# Altium schematic sheet UserJtagTester.schDOC
size A4; Organization: Altium Limited; Address1: L3, 12a Rodborough Rd; Address2: Frenchs Forest; Address3: NSW; Address4: Australia 2086; DocumentNumber: 1; SheetNumber: 13; SheetTotal: 13
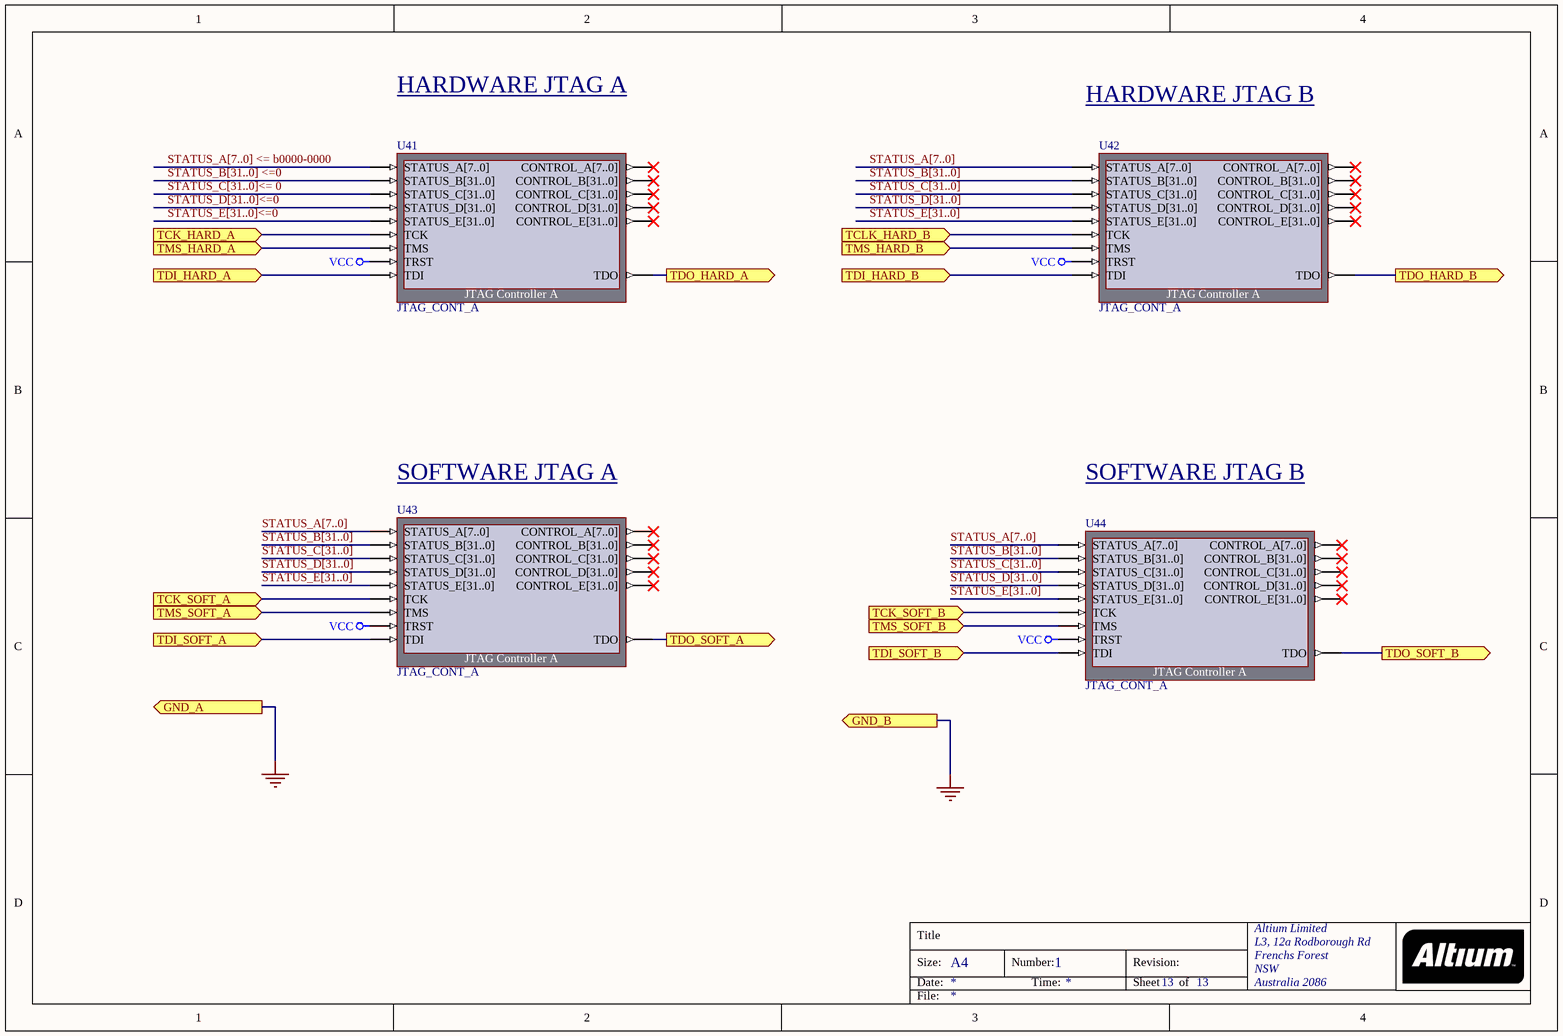
[diagram p0: UserJtagTester.schDOC]

## Parts
U41  JTAG_CONT_A
U42  JTAG_CONT_A
U43  JTAG_CONT_A
U44  JTAG_CONT_A

## Ports
GND_A (out), GND_B (out), TCK_HARD_A (in), TCK_SOFT_A (in), TCK_SOFT_B (in), TCLK_HARD_B (in), TDI_HARD_A (in), TDI_HARD_B (in), TDI_SOFT_A (in), TDI_SOFT_B (in), TDO_HARD_A (out), TDO_HARD_B (out), TDO_SOFT_A (out), TDO_SOFT_B (out), TMS_HARD_A (in), TMS_HARD_B (in), TMS_SOFT_A (in), TMS_SOFT_B (in)

## Nets
GND: port GND_A, port GND_B
VCC: U41.TRST U42.TRST U43.TRST U44.TRST
STATUS_A[7..0]: U42.STATUS_A[7..0] U43.STATUS_A[7..0] U44.STATUS_A[7..0]
STATUS_A[7..0] <= b0000-0000: U41.STATUS_A[7..0]
STATUS_B[31..0]: U42.STATUS_B[31..0] U43.STATUS_B[31..0] U44.STATUS_B[31..0]
STATUS_B[31..0] <=0: U41.STATUS_B[31..0]
STATUS_C[31..0]: U42.STATUS_C[31..0] U43.STATUS_C[31..0] U44.STATUS_C[31..0]
STATUS_C[31..0]<= 0: U41.STATUS_C[31..0]
STATUS_D[31..0]: U42.STATUS_D[31..0] U43.STATUS_D[31..0] U44.STATUS_D[31..0]
STATUS_D[31..0]<=0: U41.STATUS_D[31..0]
STATUS_E[31..0]: U42.STATUS_E[31..0] U43.STATUS_E[31..0] U44.STATUS_E[31..0]
STATUS_E[31..0]<=0: U41.STATUS_E[31..0]
TCK_HARD_A: U41.TCK ; port TCK_HARD_A
TCK_SOFT_A: U43.TCK ; port TCK_SOFT_A
TCK_SOFT_B: U44.TCK ; port TCK_SOFT_B
TCLK_HARD_B: U42.TCK ; port TCLK_HARD_B
TDI_HARD_A: U41.TDI ; port TDI_HARD_A
TDI_HARD_B: U42.TDI ; port TDI_HARD_B
TDI_SOFT_A: U43.TDI ; port TDI_SOFT_A
TDI_SOFT_B: U44.TDI ; port TDI_SOFT_B
TDO_HARD_A: U41.TDO ; port TDO_HARD_A
TDO_HARD_B: U42.TDO ; port TDO_HARD_B
TDO_SOFT_A: U43.TDO ; port TDO_SOFT_A
TDO_SOFT_B: U44.TDO ; port TDO_SOFT_B
TMS_HARD_A: U41.TMS ; port TMS_HARD_A
TMS_HARD_B: U42.TMS ; port TMS_HARD_B
TMS_SOFT_A: U43.TMS ; port TMS_SOFT_A
TMS_SOFT_B: U44.TMS ; port TMS_SOFT_B

Not connected (* = marked no-connect by the designer): U41 CONTROL_A[7..0]* CONTROL_B[31..0]* CONTROL_C[31..0]* CONTROL_D[31..0]* CONTROL_E[31..0]*; U42 CONTROL_A[7..0]* CONTROL_B[31..0]* CONTROL_C[31..0]* CONTROL_D[31..0]* CONTROL_E[31..0]*; U43 CONTROL_A[7..0]* CONTROL_B[31..0]* CONTROL_C[31..0]* CONTROL_D[31..0]* CONTROL_E[31..0]*; U44 CONTROL_A[7..0]* CONTROL_B[31..0]* CONTROL_C[31..0]* CONTROL_D[31..0]* CONTROL_E[31..0]*

## Buses and harness runs
bus STATUS_A[7..0]
bus STATUS_A[7..0] <= b0000-0000
bus STATUS_B[31..0]
bus STATUS_B[31..0] <=0
bus STATUS_C[31..0]
bus STATUS_C[31..0]<= 0
bus STATUS_D[31..0]
bus STATUS_D[31..0]<=0
bus STATUS_E[31..0]
bus STATUS_E[31..0]<=0

## Notes on the sheet
- HARDWARE JTAG A
- HARDWARE JTAG B
- (near U43) SOFTWARE JTAG A
- SOFTWARE JTAG B
- Title
- Size:
- Date:
- A4
- Number:
- Time:
- Revision:
- Sheet
- of
- File:

## Library data of the parts
U41-U44 = JTAG_CONT_A: JTAG Controller A; XXX_NEXUS_CORE: Instrument; XXX_NEXUS_JTAG_DEVICE: True; XXX_NEXUS_JTAG_ORDER: 0; Published: 13/10/2003; Publisher: Altium Hobart Technology Centre; Core Revision: 1.00.00